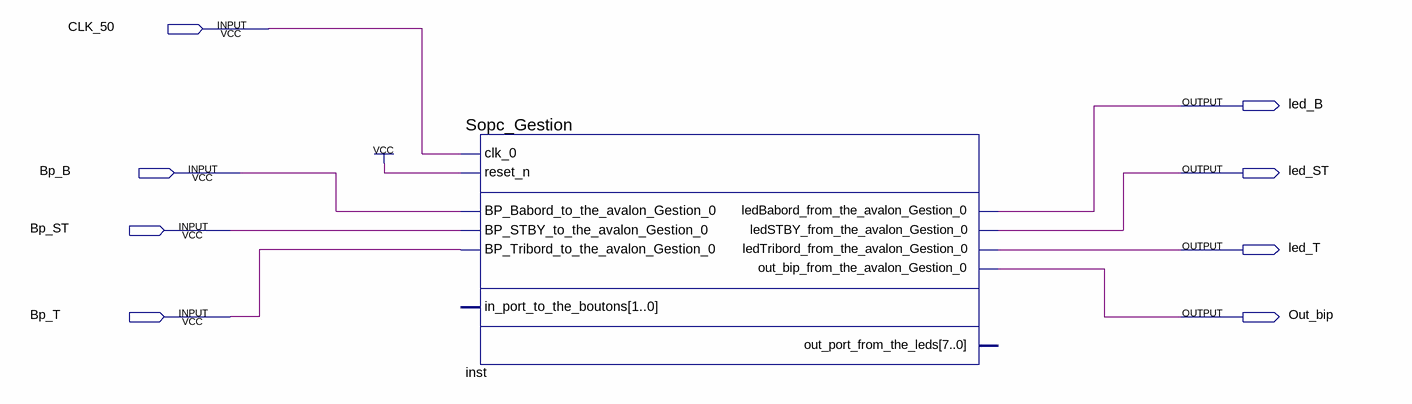
[diagram p0: schematic sheet]
// Quartus schematic mon_sopc.bdf as structural Verilog: 1 symbols, 8 pins
module mon_sopc (
  input  CLK_50,
  input  Bp_B,
  input  Bp_ST,
  input  Bp_T,
  output led_B,
  output led_ST,
  output led_T,
  output Out_bip
);

  Sopc_Gestion inst (
    .clk_0(CLK_50), .reset_n(1'b1), .BP_Babord_to_the_avalon_Gestion_0(Bp_B),
    .BP_STBY_to_the_avalon_Gestion_0(Bp_ST), .BP_Tribord_to_the_avalon_Gestion_0(Bp_T),
    .ledBabord_from_the_avalon_Gestion_0(led_B), .ledSTBY_from_the_avalon_Gestion_0(led_ST),
    .ledTribord_from_the_avalon_Gestion_0(led_T), .out_bip_from_the_avalon_Gestion_0(Out_bip));  // open: in_port_to_the_boutons, out_port_from_the_leds
endmodule
